# EAGLE design CutDown2_V1.0 (EAGLE 7.6.0)
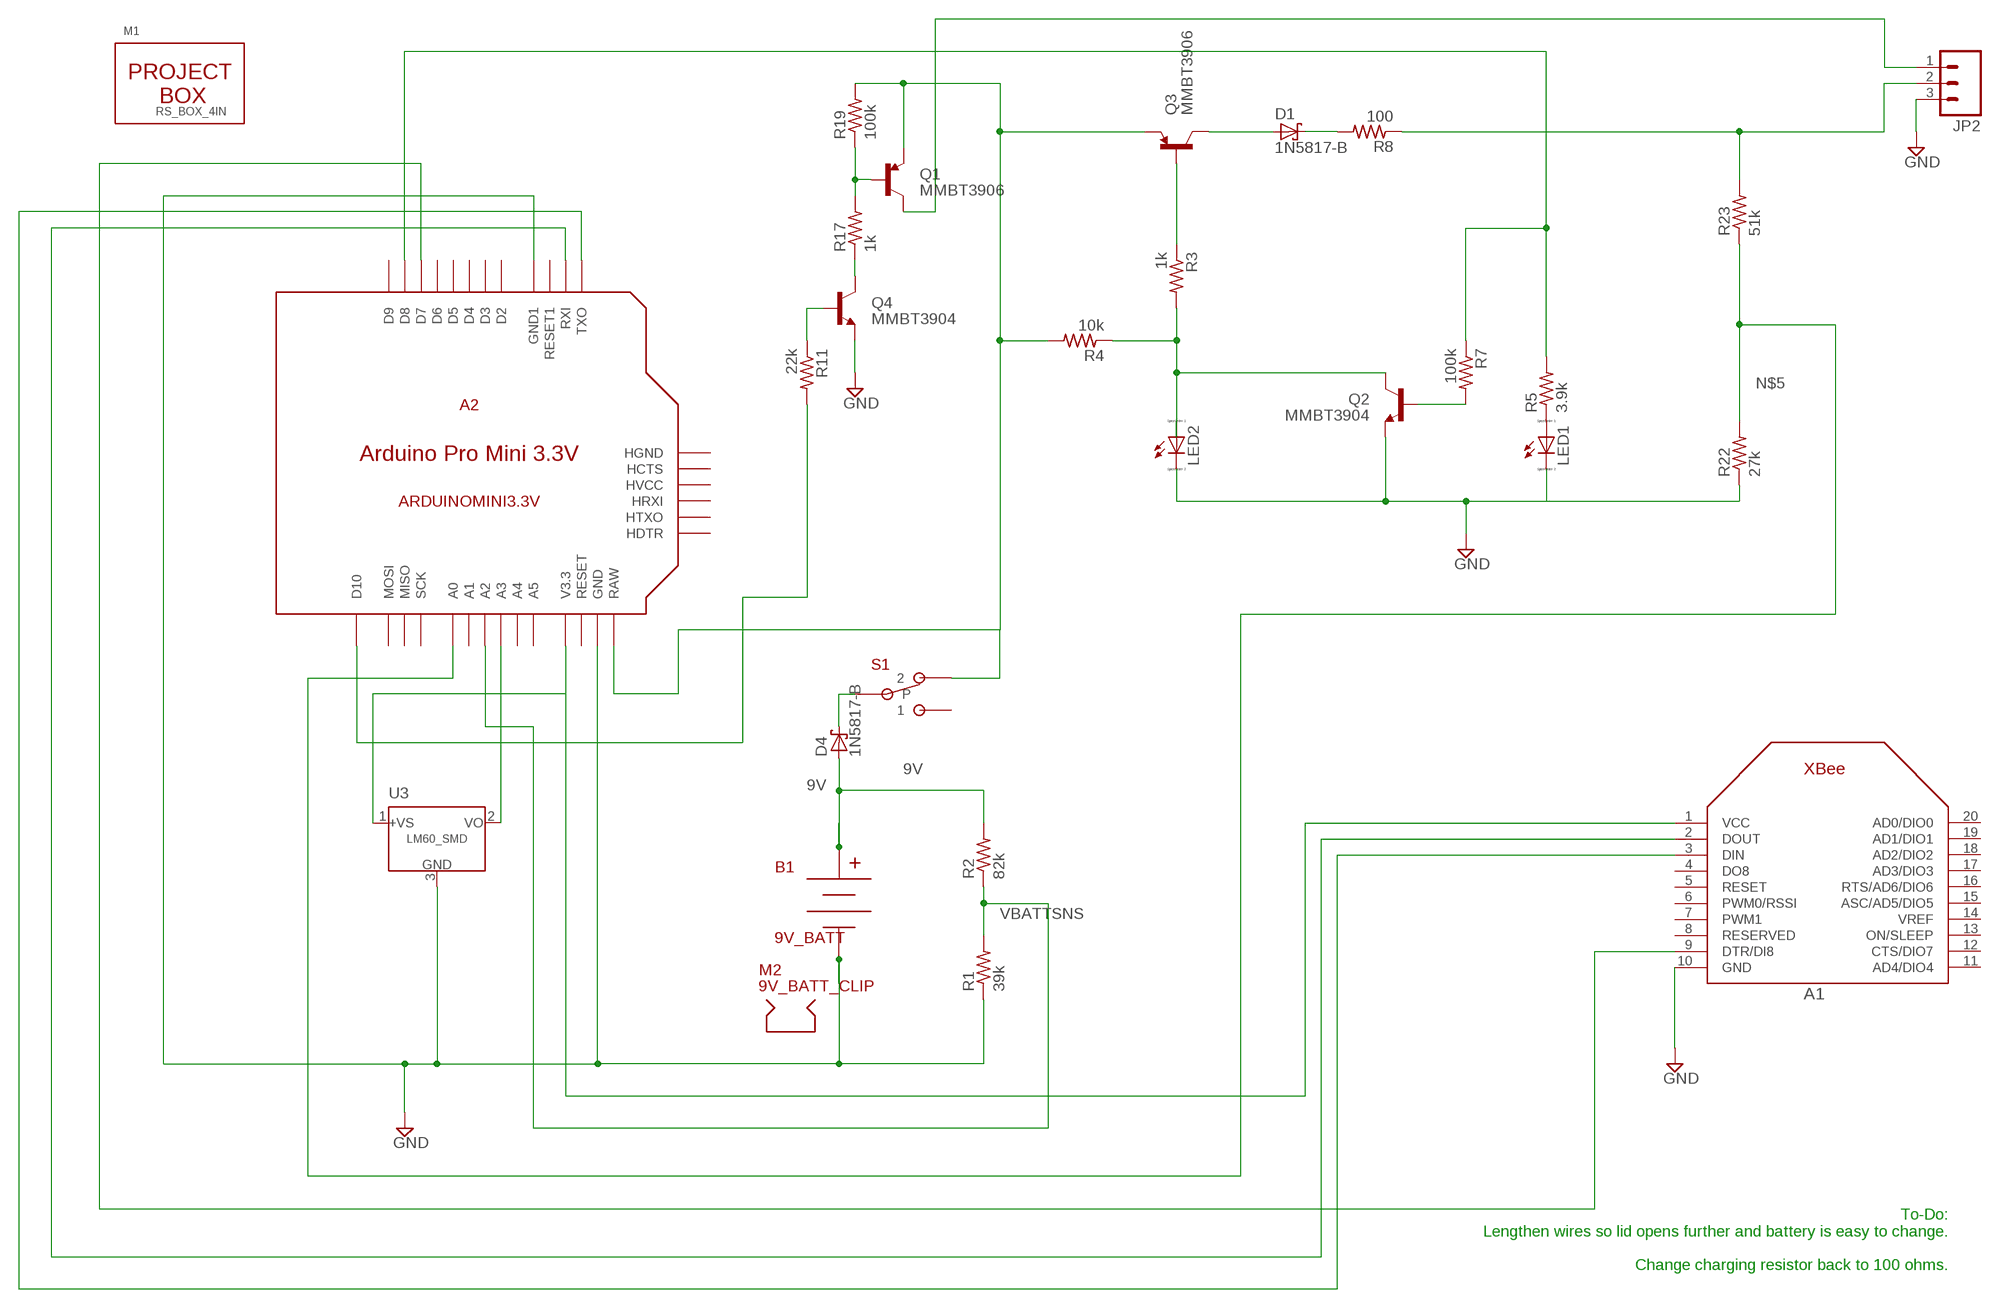
[diagram p0: schematic, sheet 1]

## Parts
A1  XBEE  [XBEE]
A2  ARDUINOMINI3.3V  [ARDUINOMINI3.3V]
B1  9V_BATT  [KEYSTONE_593_594]
D1  1N5817-B  [DO41-7.6]
D4  1N5817-B  [DO41-7.6]
JP2  M03POLAR_LOCK  [MOLEX-1X3_LOCK]
LED1  LED_ELD260  [LED_LD260]
LED2  LED_ELD260  [LED_LD260]
M1  RS_BOX_4IN  [RS_BOX_OUTLINE_4IN]
M2  9V_BATT_CLIP  [KEYSTONE_9V_CLIP_H]
Q1  MMBT3906  TRANSISTOR_PNPMMBT4403  [SOT23]
Q2  MMBT3904  TRANSISTOR_NPNSOT23  [SOT23]
Q3  MMBT3906  TRANSISTOR_PNPMMBT4403  [SOT23]
Q4  MMBT3904  TRANSISTOR_NPNSOT23  [SOT23]
R1  39k  R-US_R0805  [R0805]
R2  82k  R-US_R0805  [R0805]
R3  1k  R-US_R0805  [R0805]
R4  10k  R-US_R0805  [R0805]
R5  3.9k  R-US_R0805  [R0805]
R7  100k  R-US_R0805  [R0805]
R8  100  R-US_R0805  [R0805]
R11  22k  R-US_R0805  [R0805]
R17  1k  R-US_R0805  [R0805]
R19  100k  R-US_R0805  [R0805]
R22  27k  R-US_R0805  [R0805]
R23  51k  R-US_R0805  [R0805]
S1  APEM_SPDT_25000NH  [APEM_SPDT_25000NH]
U3  LM60_SMD  [SOT23-3]

## Nets
9V: B1.P$1(V+) B1.P$2(V+) B1.P$3(V+) D4.A R2.2
GND: A1.10(GND) A2.P$9(GND1) A2.P$20(GND) B1.P$4(V-) B1.P$5(V-) B1.P$6(V-) JP2.3 LED1.K(C) LED2.K(C) Q2.2(E) Q4.2(E) R1.1 R22.1 U3.3(GND)
N$1: Q3.1(B) R3.1
N$2: D1.A Q3.3(C)
N$3: A2.P$2(D8) R5.2 R7.1
N$4: LED1.A R5.1
N$5: A2.P$26(A0) R22.2 R23.1
N$6: D1.C R8.2
N$7: LED2.A Q2.3(C) R3.2 R4.1
N$8: A1.2(DOUT) A2.P$11(RXI)
N$9: A2.P$23(A3) U3.2(VO)
N$10: A1.3(DIN) A2.P$12(TXO)
N$11: D4.C S1.P$3(P)
N$13: Q2.1(B) R7.2
N$21: Q4.3(C) R17.1
N$22: Q1.1(B) R17.2 R19.1
N$24: JP2.1 Q1.3(C)
N$26: A2.P$30(D10) R11.2
N$31: Q4.1(B) R11.1
N$41: JP2.2 R8.1 R23.2
N$42: A2.P$19(RAW) Q1.2(E) Q3.2(E) R4.2 R19.2 S1.P$2
VBATTSNS: A2.P$24(A2) R1.2 R2.1
VCC: A1.1(VCC) A2.P$22(V3.3) U3.1(+VS)
VCSNS: A1.9(DTR/DI8) A2.P$3(D7)
Unconnected: A1.4(DO8) A1.5(RESET) A1.6(PWM0/RSSI) A1.7(PWM1) A1.8(RESERVED) A1.11(AD4/DIO4) A1.12(CTS/DIO7) A1.13(ON/SLEEP) A1.14(VREF) A1.15(ASC/AD5/DIO5) A1.16(RTS/AD6/DIO6) A1.17(AD3/DIO3) A1.18(AD2/DIO2) A1.19(AD1/DIO1) A1.20(AD0/DIO0) A2.P$1(D9) A2.P$4(D6) A2.P$5(D5) A2.P$6(D4) A2.P$7(D3) A2.P$8(D2) A2.P$10(RESET1) A2.P$13(HGND) A2.P$14(HCTS) A2.P$15(HVCC) A2.P$16(HRXI) A2.P$17(HTXO) A2.P$18(HDTR) A2.P$21(RESET) A2.P$25(A1) A2.P$27(SCK) A2.P$28(MISO) A2.P$29(MOSI) A2.P$34(A5) A2.P$35(A4) S1.P$1

## Notes on the sheet
- To-Do:
  Lengthen wires so lid opens further and battery is easy to change.
  
  Change charging resistor back to 100 ohms.

## Library data of the parts
A1 = adafruit:XBEE
A2 = fhdevices:ARDUINOMINI3.3V
B1 = fhmechanical:9V_BATT
D1 D4 = diode:1N581*: 1.0A SCHOTTKY BARRIER RECTIFIER Source: http://www.diodes.com/datasheets/ds23001.pdf
JP2 = SparkFun-Connectors:M03: Header 3 Standard 3-pin 0.1" header. Use with straight break away headers (SKU : PRT-00116), right angle break away headers (PRT-00553), swiss pins (PRT-00743), machine pins (PRT-00117), and female headers (PRT-00115). Molex polarized connector foot print use with SKU : PRT-08232 with associated crimp pins and housings.
LED1 LED2 = eagle-ltspice:LED_E: LED Source: http://www.osram.convergy.de Source: www.luxeon.com Source: www.kingbright.com; SPICEMODEL: NONE; SPICEPREFIX: D; SPICETYPE: diode
M1 = mymechanical:RS_BOX_4IN
M2 = fhmechanical:9V_BATT_CLIP
Q1 Q3 = SparkFun-DiscreteSemi:TRANSISTOR_PNP: Generic PNP BJT Double check pinouts against datasheets- not all devices are the same! MMBT3906 - 40V 200mA SOT-23 (TRANS-08052) MMBT4403 - 40V 600mA SOT-23 (TRANS-09245); PROD_ID: TRANS-09245; VALUE: MMBT4403
Q2 Q4 = SparkFun-DiscreteSemi:TRANSISTOR_NPN: Generic NPN BJT MMBT2222A - TRANS-08049 (SOT-23, 1A 40V) MPSA42 - TRANS-09116 (SOT-23, 500mA 300V) MMBT5088LT1G - TRANS-11160 (SOT-23, 50 mA 30V) BC547 - COM-08928 <http://www.sparkfun.com/products/8928> (TO-92 45V 100mA) (1.Collector 2.Base 3.Emitter) 2N3904 - COM-00521 <http://www.sparkfun.com/products/521> (TO-92 40V 200mA) (1.Emitter 2.Base 3.Collector) P2N2222A - COM-12852 <http://www.sparkfun.com/products/12852> (TO-92 40V 600mA) (1.Collector 2.Base 3.Emitter)
R1-R5 R7 R8 R11 R17 R19 R22 R23 = resistor:R-US_: RESISTOR, American symbol
S1 = fhmechanical:APEM_SPDT_25000NH
U3 = mydevices:LM60

## Board
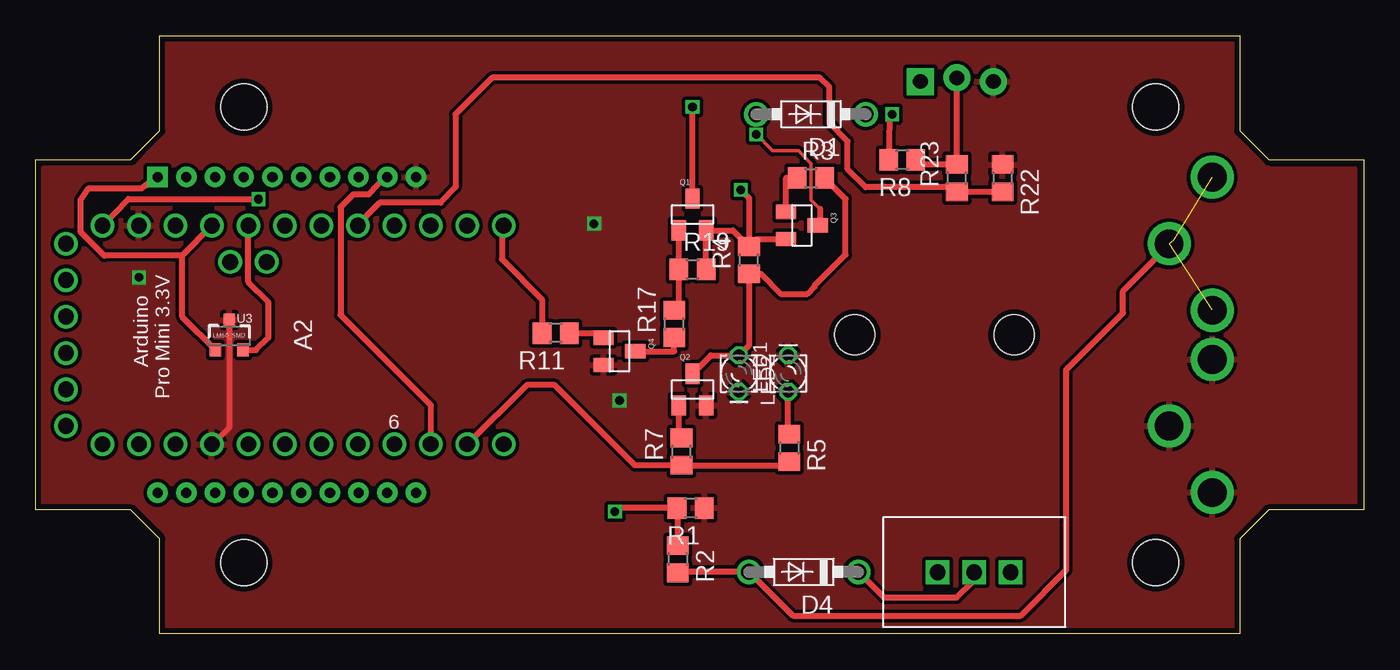
[diagram p1: board, top side]
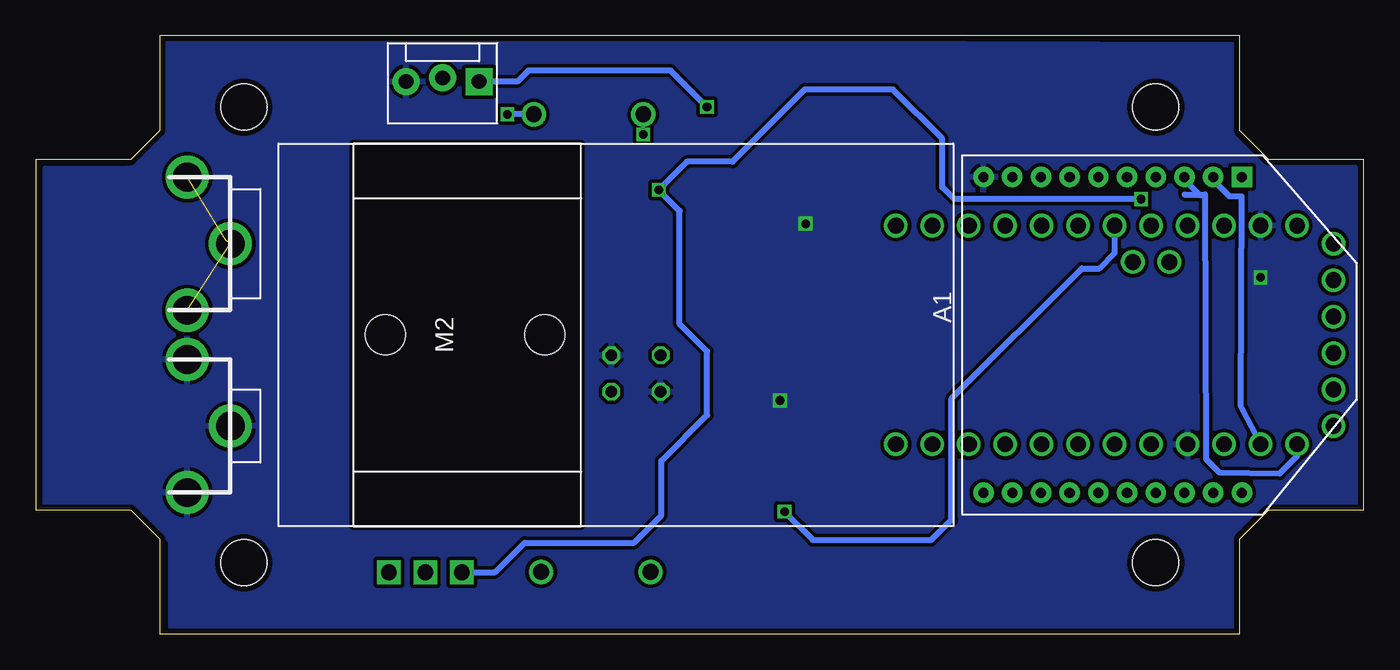
[diagram p2: board, bottom side, seen from below]

Size 92.46 x 41.66 mm. Coordinates in mm from the lower left corner, seen from the top.
Copper layers (1*16): Top 0.0356mm / dielectric 1.5011mm / Bottom 0.0356mm
Design rules "oshpark-2layer": minimum track width 6mil, minimum drill 13mil, track to track 6mil, track to pad 6mil, pad to pad 6mil, via to via 6mil, smd to smd 6mil, copper to edge 15mil, drill to drill 6mil, minimum pad ring 7mil, minimum via ring 7mil, stop-mask expansion 2.5mil, vias tented up to drill 0mil, thermal gap 10mil

### Footprints (pad centres in the part's own frame; a part is rotated, then mirrored left to right if it is on the bottom)
XBEE = drill 0.7 pad 1.422 square: 1 -11,5.5 | drill 0.7 pad 1.422: 2 -11,3.5; 3 -11,1.5; 4 -11,-0.5; 5 -11,-2.5; 6 -11,-4.5; 7 -11,-6.5; 8 -11,-8.5; 9 -11,-10.5; 10 -11,-12.5; 11 11,-12.5; 12 11,-10.5; 13 11,-8.5; 14 11,-6.5; 15 11,-4.5; 16 11,-2.5; 17 11,-0.5; 18 11,1.5; 19 11,3.5; 20 11,5.5
ARDUINOMINI3.3V = drill 1.1: P$1 -7.62,-13.97; P$2 -7.62,-11.43; P$3 -7.62,-8.89; P$4 -7.62,-6.35; P$5 -7.62,-3.81; P$6 -7.62,-1.27; P$7 -7.62,1.27; P$8 -7.62,3.81; P$9 -7.62,6.35; P$10 -7.62,8.89; P$11 -7.62,11.43; P$12 -7.62,13.97; P$13 -6.35,16.51; P$14 -3.81,16.51; P$15 -1.27,16.51; P$16 1.27,16.51; P$17 3.81,16.51; P$18 6.35,16.51; P$19 7.62,13.97; P$20 7.62,11.43; P$21 7.62,8.89; P$22 7.62,6.35; P$23 7.62,3.81; P$24 7.62,1.27; P$25 7.62,-1.27; P$26 7.62,-3.81; P$27 7.62,-6.35; P$28 7.62,-8.89; P$29 7.62,-11.43; P$30 7.62,-13.97; P$34 5.08,5.08; P$35 5.08,2.54
KEYSTONE_593_594 = drill 2: P$1 -10.986,0; P$2 -1.714,0; P$3 -6.35,2.997; P$4 1.714,0; P$5 10.986,0; P$6 6.35,2.997
DO41-7.6 = drill 1.1 pad 1.7: A 3.81,0; C -3.81,0
MOLEX-1X3_LOCK = drill 1.016 pad 1.88 square: 1 0,0.127 | drill 1.016 pad 1.88: 2 2.54,-0.127; 3 5.08,0.127
LED_LD260 = drill 0.813 octagon: A -1.27,0; K 1.27,0
RS_BOX_OUTLINE_4IN = hole 3.2: -31.75,15.875; -31.75,-15.875; 31.75,-15.875; 31.75,15.875
KEYSTONE_9V_CLIP_H = hole 2.8: 0,-5.715; 0,5.385
SOT23 = smd 1 x 1.4: 1 -0.95,-1.1; 2 0.95,-1.1; 3 0,1.1
R0805 = smd 1.3 x 1.5: 1 -0.95,0; 2 0.95,0
APEM_SPDT_25000NH = drill 1.1 square: P$1 2.54,0; P$2 -2.54,0; P$3 0,0
SOT23-3 = smd 0.8 x 0.9: 1 -0.95,-1; 2 0.95,-1; 3 0,1.1

### Placement (x,y rotation side)
A1  13.97,20.83 270 bottom
A2  18.61,20.83 90 top
B1  81.92,20.83 270 bottom
D1  53.98,36.2 180 top
D4  53.47,4.32 180 top
JP2  61.59,38.61 180 bottom
LED1  52.39,18.13 90 top
LED2  48.96,18.13 270 top
M1  46.23,20.83 0 top
M2  62.74,20.83 90 bottom
Q1  45.72,29.21 0 top
Q2  45.72,17.02 0 top
Q3  53.34,28.45 270 top
Q4  40.64,19.68 270 top
R1  45.59,8.76 180 top
R2  44.7,5.21 270 top
R3  53.98,31.75 0 top
R4  49.66,26.04 90 top
R5  52.45,12.95 270 top
R7  44.96,12.7 90 top
R8  60.33,33.02 180 top
R11  36.2,20.95 180 top
R17  44.45,21.59 90 top
R19  45.72,25.4 0 top
R22  67.31,31.75 270 top
R23  64.14,31.75 90 top
S1  65.34,4.29 0 top
U3  13.46,20.76 0 top

### Tracks (layer width: path | path; a pad name or v marks a point on that pad's centre or on a via)
9V  (3 unrouted)
  Top 0.406: R2.2 44.77,4.32 D4.A 52.7,1.27 68.58,1.27 71.75,4.45 71.75,18.41 75.69,22.35 75.69,23.88 79.25,27.43
GND  (via drill 0.6)
  Top 0.406: U3.3 13.46,14.39 A2.P$9
  other vias: 7.18,24.83 38.86,28.57 40.64,16.26
  pour Top (isolate 0.254): 9.14,0.51 9.14,6.99 6.99,9.14 0.51,9.14 0.51,32.38 0.64,32.51 6.99,32.51 9.14,34.92 9.14,41.27 83.31,41.27 83.31,34.92 85.85,32.38 91.82,32.38 91.82,9.14 85.47,9.14 83.31,6.48 83.31,0.51
  pour Bottom (isolate 0.254): 9.14,0.51 9.14,6.99 6.99,9.14 0.51,9.14 0.51,32.38 0.64,32.51 6.99,32.51 9.14,34.67 9.14,41.02 83.31,41.27 83.31,34.92 85.85,32.38 91.82,32.38 91.82,9.14 85.72,9.14 83.06,6.48 83.06,0.51
N$1
  Top 0.406: Q3.1 52.24,31.75 R3.1
N$2  (via drill 0.6)
  Top 0.254: 54.61,29.59 53.98,30.23 53.98,32.77 53.09,33.66 51.31,33.66 v50.16,34.8
  Top 0.406: 54.61,29.59 54.61,28.62 Q3.3
  Bottom 0.254: v50.16,34.8 D1.A
N$3
  Top 0.406: A2.P$2 34.19,17.34 36.13,17.34 41.72,11.75 R7.1 52.2,11.75 R5.2
N$4
  Top 0.406: R5.1 52.39,13.97 LED1.A
N$5
  Top 0.406: R22.2 R23.1 63.82,31.11 57.78,31.11 56.52,32.38 56.52,34.29 55.24,35.56 55.24,38.1 54.61,38.73 31.75,38.73 29.21,36.2 29.21,31.11 28.19,30.04 23.94,30.04 22.41,28.51 A2.P$26
N$6  (via drill 0.6)
  Top 0.406: v59.63,36.2 59.44,35.75 59.37,33.08 R8.2
  Bottom 0.406: D1.C v59.63,36.2
N$7
  Top 0.406: R3.2 56.39,30.29 56.39,26.42 54.23,24.26 54.23,24.19 53.72,23.69 51.88,23.69 50.48,25.09 R4.1 49.66,20.1 LED2.A 47,19.4 Q2.3
N$8
  Bottom 0.406: A1.2 10.47,31.62 9.34,30.48 8.51,30.48 8.57,15.91 8.45,15.62 A2.P$11
N$9
  Top 0.406: U3.2 15.32,19.77 16.19,20.64 16.19,23.11 14.79,24.51 A2.P$23
N$10
  Bottom 0.406: A1.3 12.47,31.65 11.37,30.54 12.47,30.61 11.05,30.61 10.99,12.19 10.03,11.24 5.84,11.18 4.63,12.38 A2.P$12
N$11
  Top 0.406: D4.C 59.05,2.54 64.14,2.54 65.34,3.75 S1.P$3
N$13
  Top 0.406: R7.2 44.77,13.84 Q2.1
N$21
  Top 0.406: Q4.3 44.45,19.68 R17.1
N$22
  Top 0.406: R17.2 44.77,22.54 R19.1 Q1.1
N$24  (via drill 0.6)
  Top 0.406: Q1.3 v45.72,36.7
  Bottom 0.406: v45.72,36.7 48.26,39.24 58.17,39.24 58.93,38.48 JP2.1
N$26
  Top 0.406: A2.P$30 32.54,28.38 32.45,28.38 32.45,26.1 35.24,23.3 R11.2
N$31
  Top 0.406: R11.1 39.54,20.95 Q4.1
N$41
  Top 0.406: R8.1 61.59,32.7 R23.2 JP2.2
N$42  (via drill 0.6)
  Top 0.406: R19.2 Q1.2 48.53,28.11 R4.2 | R4.2 50.17,27.5 Q3.2 | A2.P$19 6.44,30.29 v15.49,30.29 | v49.09,30.92 49.66,30.35 R4.2
  Bottom 0.406: v15.49,30.29 28.51,30.29 29.34,31.11 29.34,34.48 32.77,37.91 38.92,37.91 43.94,32.89 47.12,32.89 v49.09,30.92 47.62,29.46 47.62,21.59 45.72,19.68 45.72,15.24 48.9,12.06 48.9,8.26 50.8,6.35 58.42,6.35 60.48,4.29 S1.P$2
VBATTSNS  (via drill 0.6)
  Top 0.406: R2.1 44.7,8.7 R1.2 40.58,8.76 v40.32,8.51
  Bottom 0.406: v40.32,8.51 38.35,6.54 30.1,6.54 28.7,7.94 28.7,16.38 19.62,25.46 18.41,25.46 17.33,26.54 A2.P$24
VCC
  Top 0.406: A2.P$22 10.19,26.35 | 10.19,26.35 4.76,26.35 3.11,28 3.11,30.23 3.68,31.05 7.37,31.05 8.47,31.9 A1.1 8.2,31.69 | U3.1 10.19,22.09 10.19,26.35
VCSNS
  Top 0.406: A1.9 24.46,31.95 23.18,30.61 22.1,30.61 21.21,29.72 21.21,22.23 27.5,15.94 A2.P$3 27.5,13.18